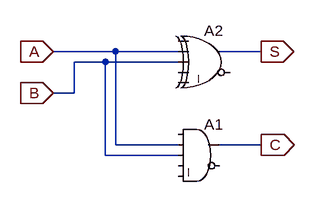
[diagram p0: schematic HalfAdder.asc]
HalfAdder.asc, the LTspice schematic file:
Version 4
SHEET 1 880 680
WIRE 128 128 32 128
WIRE 224 128 128 128
WIRE 352 128 288 128
WIRE 112 144 64 144
WIRE 224 144 112 144
WIRE 64 192 64 144
WIRE 64 192 32 192
WIRE 128 272 128 128
WIRE 224 272 128 272
WIRE 352 272 288 272
WIRE 112 288 112 144
WIRE 224 288 112 288
FLAG 32 128 A
IOPIN 32 128 In
FLAG 32 192 B
IOPIN 32 192 In
FLAG 352 272 C
IOPIN 352 272 Out
FLAG 352 128 S
IOPIN 352 128 Out
SYMBOL Digital\\and 256 224 R0
SYMATTR InstName A1
SYMBOL Digital\\xor 272 80 R0
SYMATTR InstName A2

The netlist it stands for:
* HalfAdder.asc
A1 0 A B 0 0 0 C 0 AND
A2 0 A B 0 0 0 S 0 XOR
.backanno
.end